# Altium schematic sheet MAIN.SchDoc: Robot Car
size A4; Engineer: Alisya K; DocumentNumber: 1; SheetNumber: 1; SheetTotal: 1; Project: Remote Controlled Car Driver; ENG_APP_DATE: --/--/--; DSN_APP_DATE: --/--/--; CHK_APP_DATE: --/--/--; SchTitle: MAIN; SchBrief: Motorized toy car controlled by infrared remote and ultrasonic sensor.
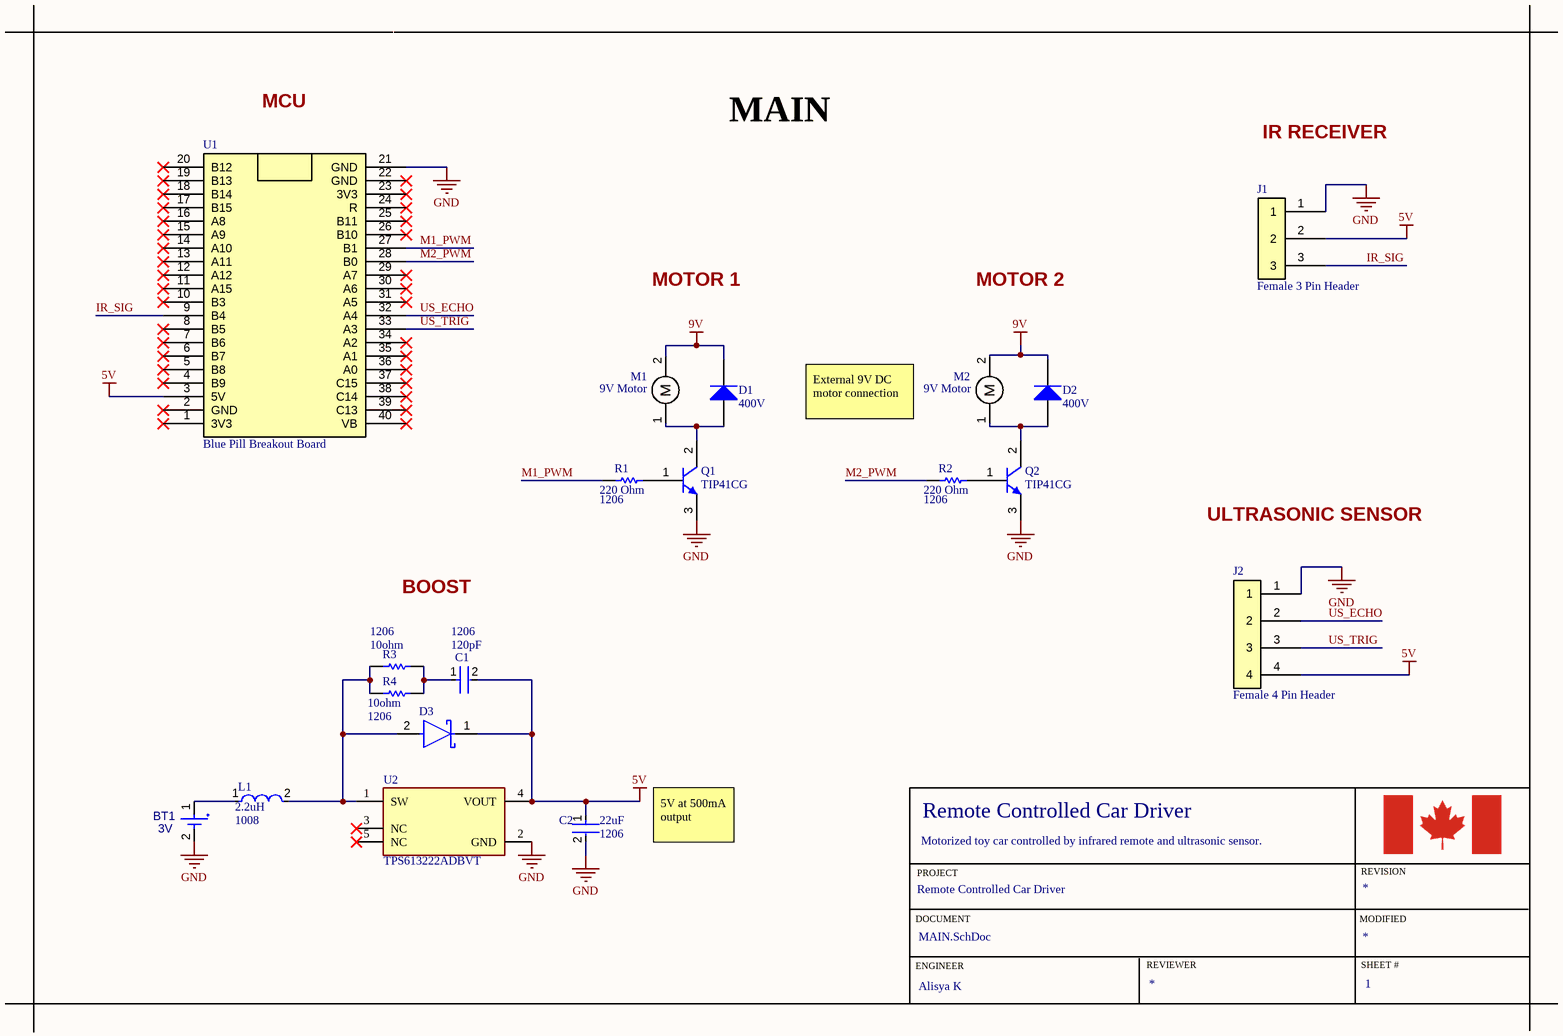
[diagram p0: MAIN.SchDoc]

## Parts
BT1  3V  [New footprint 1]
C1  Case/Package: 1206  Capacitance: 120pF  [FP-GRM31A-0_2-e0_3_0_95-IPC_B]  (hidden comment: GRM31A7U3A121JW31D)
C2  Case/Package: 1206  Capacitance: 22uF  [FP-C3216-160-0_2-IPC_B]  (hidden comment: C3216X5R1V226M160AC)
D1  Reverse Voltage-Max [Vrrm]: 400V  [DIOD-SMA-2_V]  (hidden comment: S1G-13-F)
D2  Reverse Voltage-Max [Vrrm]: 400V  [DIOD-SMA-2_V]  (hidden comment: S1G-13-F)
D3  MSS1P4-M3/89A  [FP-96591-MFG]  (value not drawn)
J1  Female 3 Pin Header  [Female 4 Pin Header-Footprint-1]
J2  Female 4 Pin Header  [Female 4 Pin Header-Footprint-1]
L1  Case/Package: 1008  Inductance: 2.2uH  [FP-DFE252012C-IPC_B]  (hidden comment: DFE252012F-2R2M=P2)
M1  9V Motor  [9V Motor-Footprint-1]
M2  9V Motor  [9V Motor-Footprint-1]
Q1  TIP41CG  [ONSC-TO-220-3-221A-09]
Q2  TIP41CG  [ONSC-TO-220-3-221A-09]
R1  value 220 Ohm  Package: 1206  [RESC3216X60X45ML10T20]  (hidden comment: CRCW1206220RFKEA)
R2  value 220 Ohm  Package: 1206  [RESC3216X60X45ML10T20]  (hidden comment: CRCW1206220RFKEA)
R3  value 10ohm  Package: 1206  [RESC3216X60X45NL10T20]  (hidden comment: CRCW120610R0FKTA)
R4  value 10ohm  Package: 1206  [RESC3216X60X45NL10T20]  (hidden comment: CRCW120610R0FKTA)
U1  Blue Pill Breakout Board  [Blue Pill Breakout Board-Footprint-1]
U2  TPS613222ADBVT  [FP-DBV0005A-MFG]

## Nets
5V: C1.2 C2.1 D3.1(C) J1.2 J2.4 U1.3(5V) U2.4(VOUT)
9V: D1.2(K) D2.2(K) M1.2 M2.2
GND: BT1.2(-) C2.2 J1.1 J2.1 Q1.3(E) Q2.3(E) U1.21(GND) U2.2(GND)
IR_SIG: J1.3 U1.9(B4)
M1_PWM: R1.1 U1.27(B1)
M2_PWM: R2.1 U1.28(B0)
US_ECHO: J2.2 U1.32(A4)
US_TRIG: J2.3 U1.33(A3)
NetBT1_1: BT1.1(+) L1.1
NetC1_1: C1.1 R3.2 R4.2
NetD1_1: D1.1(A) M1.1 Q1.2(C)
NetD2_1: D2.1(A) M2.1 Q2.2(C)
NetD3_2: D3.2(A) L1.2 R3.1 R4.1 U2.1(SW)
NetQ1_1: Q1.1(B) R1.2
NetQ2_1: Q2.1(B) R2.2

Not connected (* = marked no-connect by the designer): U1 1(3V3)* 2(GND)* 4(B9)* 5(B8)* 6(B7)* 7(B6)* 8(B5)* 10(B3)* 11(A15)* 12(A12)* 13(A11)* 14(A10)* 15(A9)* 16(A8)* 17(B15)* 18(B14)* 19(B13)* 20(B12)* 22(GND)* 23(3V3)* 24(R)* 25(B11)* 26(B10)* 29(A7)* 30(A6)* 31(A5)* 34(A2)* 35(A1)* 36(A0)* 37(C15)* 38(C14)* 39(C13)* 40(VB)*; U2 3(NC)* 5(NC)*

## Notes on the sheet
- MCU
- IR RECEIVER
- MOTOR 1
- MOTOR 2
- External 9V DC motor connection
- ULTRASONIC SENSOR
- BOOST
- 5V at 500mA output
- DOCUMENT
- PROJECT
- MODIFIED
- REVISION
- ENGINEER
- REVIEWER
- SHEET #
- (in symbol CMP-00030-00001-4) M

## Library data of the parts
BT1 = CMP-00029-00001-1
C1 = CMP-06035-044906-1: Chip Multilayer Ceramic Capacitors for General Purpose, 1206, 120pF, U2J, -750ppm/°C, 5%, 1kV; Depth: 1.6mm; Height: 1mm; Width: 0.063inch; Dielectric: U2J; Max Operating Temperature: 125°C; Mount: Surface Mount; Case Code (Imperial): 1206; Voltage Rating (DC): 1kV; Length: 3.2mm; Case Code (Metric): 3216; Package Quantity: 4000; Packaging: Tape and Reel; Min Operating Temperature: -55°C; Radiation Hardening: No; Voltage Rating: 1kV; Termination: SMD/SMT; Tolerance: 5%; Thickness: 0.039inch
C2 = CMP-2000-05398-2: Multilayer Ceramic Capacitors 22uF ±20% 35V X5R SMD 1206; Mount: Surface Mount; Voltage Rating: 35V; Length: 3.2mm; Width: 0.063inch; Dielectric Material: Ceramic; Series: C; Voltage Rating (DC): 35V; Construction: Flat; Tolerance: 20%; Dielectric: X5R; Voltage: 35V; Min Operating Temperature: -55°C; Case Code (Metric): 3216; Termination: SMD/SMT; Resistor Type: Ceramic; RoHS Compliant: Yes; Height: 1.6mm; Depth: 1.6mm; Radiation Hardening: No; Package Quantity: 2000; REACH SVHC: No SVHC; Case Code (Imperial): 1206; Weight: 0.000571oz; Max Operating Temperature: 85°C; Packaging: Tape and Reel; Thickness: 1.6mm; Lead Free: Lead Free
D1 D2 = CMP-2000-07012-1: Glass Passivated Rectifier, 1 A, 400 V, -65 to 150 degC, 2-Pin SMD, RoHS, Tape and Reel; Manufacturer: Diodes Inc; Peak Current-Max: 30A; Average Rectified Current-Max: 1A; Reverse Current-Max: 5µA; Forward Voltage: 1.1V; Manufacturer URL: http://www.diodes.com/; Package Reference: SMA-2; Datasheet URL: http://www.diodes.com/_files/datasheets/ds16003.pdf; Datasheet Version: Rev. 24-2, 12/2014; Mounting Technology: SurfaceMount; Package Description: 2-Pin Surface Mounted Assembly, Body 4.3 x 2.605 mm, Height 2.4 mm
D3 = CMP-02539-000019-1: DIODE SCHOTTKY 40V 1A MICROSMP; Manufacturer: Vishay; Value: 50pF; Peak Reverse Current: 8.5uA; Max Junction Temp: +150°C; Max Surge Forward Current: 25A; Mouser Description: Schottky Diodes & Rectifiers 1.0 Amp 40 Volt; Category: Diode; Height: 0.73mm; Temperature Range High: +150°C; Temperature Range Low: -55°C; ComponentLink2URL: http://www.vishay.com/docs/89019/mss1p4.pdf; Forward Current: 1A; Device Class L1: Discrete Semiconductors; Lead Free: Yes; Octopart: https://octopart.com/mss1p4-m3%2F89a-vishay-42505723; ComponentLink2Description: Datasheet; Digikey Description: DIODE SCHOTTKY 40V 1A MICROSMP; Footprint Url: http://www.vishay.com/docs/96591/microsmp_do-219ad_fredpt.pdf; Package: 96591; Temperature: -55°C to +150°C; Device Class L2: Diodes; Manufacturer Part Number: MSS1P4-M3/89A; Automotive: No; RoHS: TRUE; Device Class L3: Schottky Diodes; Capacitance: 50pF; Max Repetitive Reverse Voltage: 40V
J1 = CMP-002-00071-1: Gender: Female
J2 = CMP-002-00072-1
L1 = CMP-06042-014676-1: Shielded Wirewound Inductor 2.2uH 20% 2300mA 0.082Ω 1008 (2520); DC Resistance (DCR): 82mR; Test Frequency: 1MHz; Saturation Current: 3.6A; Core Material: Ferrite; Current Rating: 2.3A; Tolerance: 20%; Max Operating Temperature: 125°C; Shielding: Shielded; Height - Seated (Max): 0.047inch; Packaging: Tape and Reel; Min Operating Temperature: -40°C; Length: 0.098inch; Width: 0.079inch; Case Code (Imperial): 1008; Mount: Surface Mount; Case Code (Metric): 2520
M1 M2 = CMP-00030-00001-4
Q1 Q2 = CMP-1048-01176-1: Complementary Silicon Plastic Power Transistor, 3-Pin TO-220, Pb-Free, Tube; Manufacturer: On Semiconductor; fT Min (MHz): 3; Polarity: NPN; IC Continuous (A): 6; ComponentLink2URL: http://www.onsemi.com/pub_link/Collateral/TIP41A-D.PDF; ComponentLink2Description: Datasheet; RoHS: TRUE; ComponentLink1Description: Manufacturer URL; ComponentLink1URL: http://www.onsemi.com/; PackageDescription: 3-Pin Flange Mount, Vertical Straight Lead, Body 9.97 x 4.445 mm, Pitch 2.54 mm; Packing: Tube; PartNumber: TIP41CG; DatasheetVersion: Rev. 10; PackageVersion: Rev. AG, 09/2011; ComponentLink3Description: Package Specification; PackageReference: TO-220-3-221A-09; Mounting Technology: Through Hole; ComponentLink3URL: http://www.onsemi.com/pub_link/Collateral/221A-09.PDF
R1 R2 = CMP-2003-01956-1: Manufacturer: Vishay Dale; Part Number: CRCW1206220RFKEA
R3 R4 = CMP-2003-02505-1: Manufacturer: Vishay Dale; Part Number: CRCW120610R0FKTA
U1 = CMP-020-00023-5: STM32F103C6T6A; Clock Frequency: 72mHz
U2 = CMP-04918-000400-1: IC REG BOOST 5V 2.5A SOT23-5; Number of Outputs: 1; Synchronous Rectifier: Yes; Output Configuration: Positive; Switching Frequency: 2MHz; Output Type: Fixed; Max Input Voltage: 5.5V; Min Input Voltage: 900mV; Mount: Surface Mount; Packaging: Tape and Reel; Min Output Voltage: 5V; Output Current: 2.5A; Min Operating Temperature: -40°C; Max Operating Temperature: 85°C; Topology: Boost; RoHS Compliant: Yes; Case/Package: SOT-23-5